# EAGLE design Statemachine_ST7735.R03 (EAGLE 6.5.0)
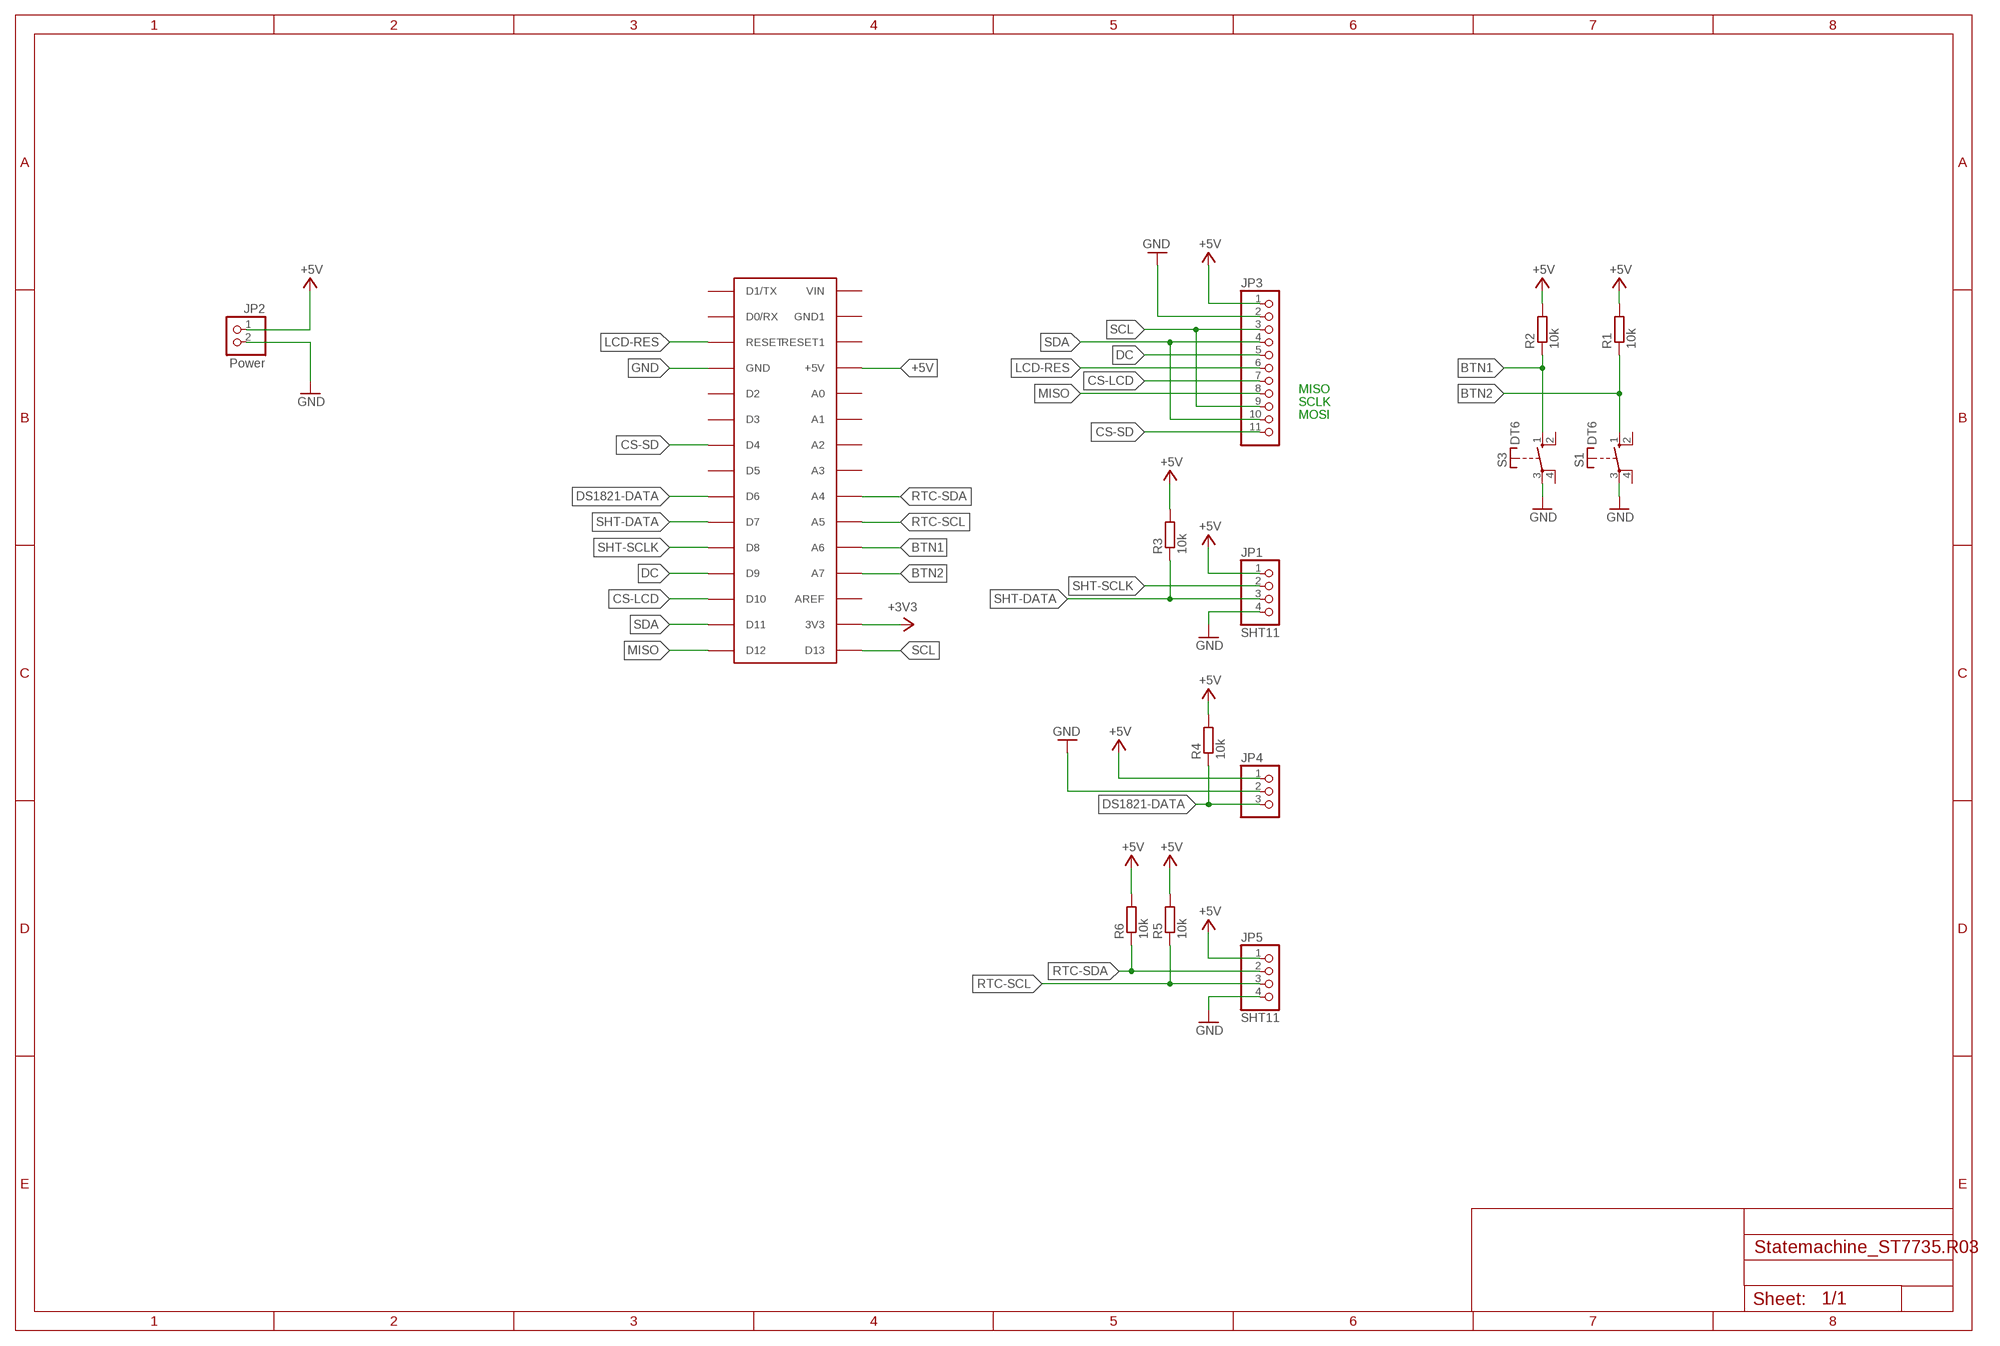
[diagram p0: schematic, sheet 1]

## Parts
JP1  SHT11  PINHD-1X4  [1X04]
JP2  Power  PINHD-1X2  [1X02]
JP3  PINHD-1X11  [1X11]
JP4  PINHD-1X3  [1X03]
JP5  SHT11  PINHD-1X4  [1X04]
NANO  ARDUINONANO  [PDIP-32]
R1  10k  R-EU_0204/7  [0204/7]
R2  10k  R-EU_0204/7  [0204/7]
R3  10k  R-EU_0204/7  [0204/7]
R4  10k  R-EU_0204/7  [0204/7]
R5  10k  R-EU_0204/7  [0204/7]
R6  10k  R-EU_0204/7  [0204/7]
S1  DT6  [DT6]
S3  DT6  [DT6]

## Nets
+3V3: NANO.3V3
+5V: JP1.1 JP2.1 JP3.1 JP4.1 JP5.1 NANO.+5V R1.2 R2.2 R3.2 R4.2 R5.2 R6.2
BTN1: NANO.A6 R2.1 S3.1(S)
BTN2: NANO.A7 R1.1 S1.1(S)
CS-LCD: JP3.7 NANO.D10
CS-SD: JP3.11 NANO.D4
DC: JP3.5 NANO.D9
DS1821-DATA: JP4.3 NANO.D6 R4.1
GND: JP1.4 JP2.2 JP3.2 JP4.2 JP5.4 NANO.GND S1.3(P) S3.3(P)
LCD-RES: JP3.6 NANO.RESET
MISO: JP3.8 NANO.D12
RTC-SCL: JP5.3 NANO.A5 R5.1
RTC-SDA: JP5.2 NANO.A4 R6.1
SCL: JP3.3 JP3.9 NANO.D13
SDA: JP3.4 JP3.10 NANO.D11
SHT-DATA: JP1.3 NANO.D7 R3.1
SHT-SCLK: JP1.2 NANO.D8
Unconnected: NANO.A0 NANO.A1 NANO.A2 NANO.A3 NANO.AREF NANO.D0/RX NANO.D1/TX NANO.D2 NANO.D3 NANO.D5 NANO.GND1 NANO.RESET1 NANO.VIN S1.2(S) S1.4(P) S3.2(S) S3.4(P)

## Notes on the sheet
- MISO
- SCLK
- MOSI

## Library data of the parts
JP1 JP5 = pinhead:PINHD-1X4: PIN HEADER
JP2 = pinhead:PINHD-1X2: PIN HEADER
JP3 = pinhead:PINHD-1X11: PIN HEADER
JP4 = pinhead:PINHD-1X3: PIN HEADER
NANO = arduino:ARDUINONANO
R1-R6 = resistor:R-EU_: RESISTOR, European symbol
S1 S3 = switch-misc:DT: ITT SWITCH

## Board
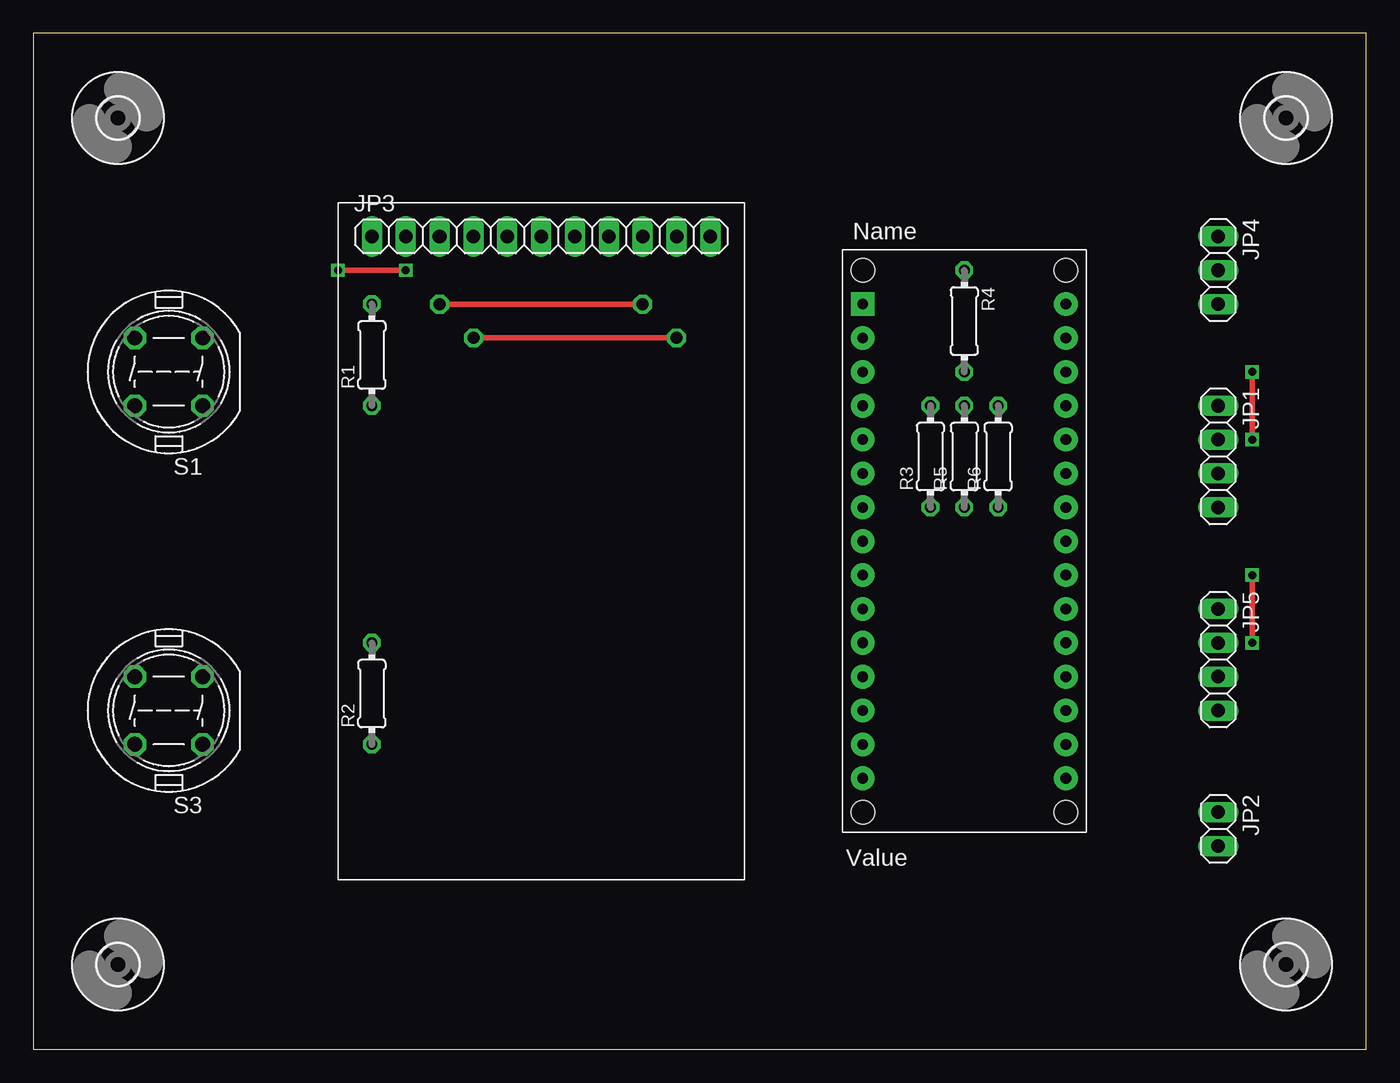
[diagram p1: board, top side]
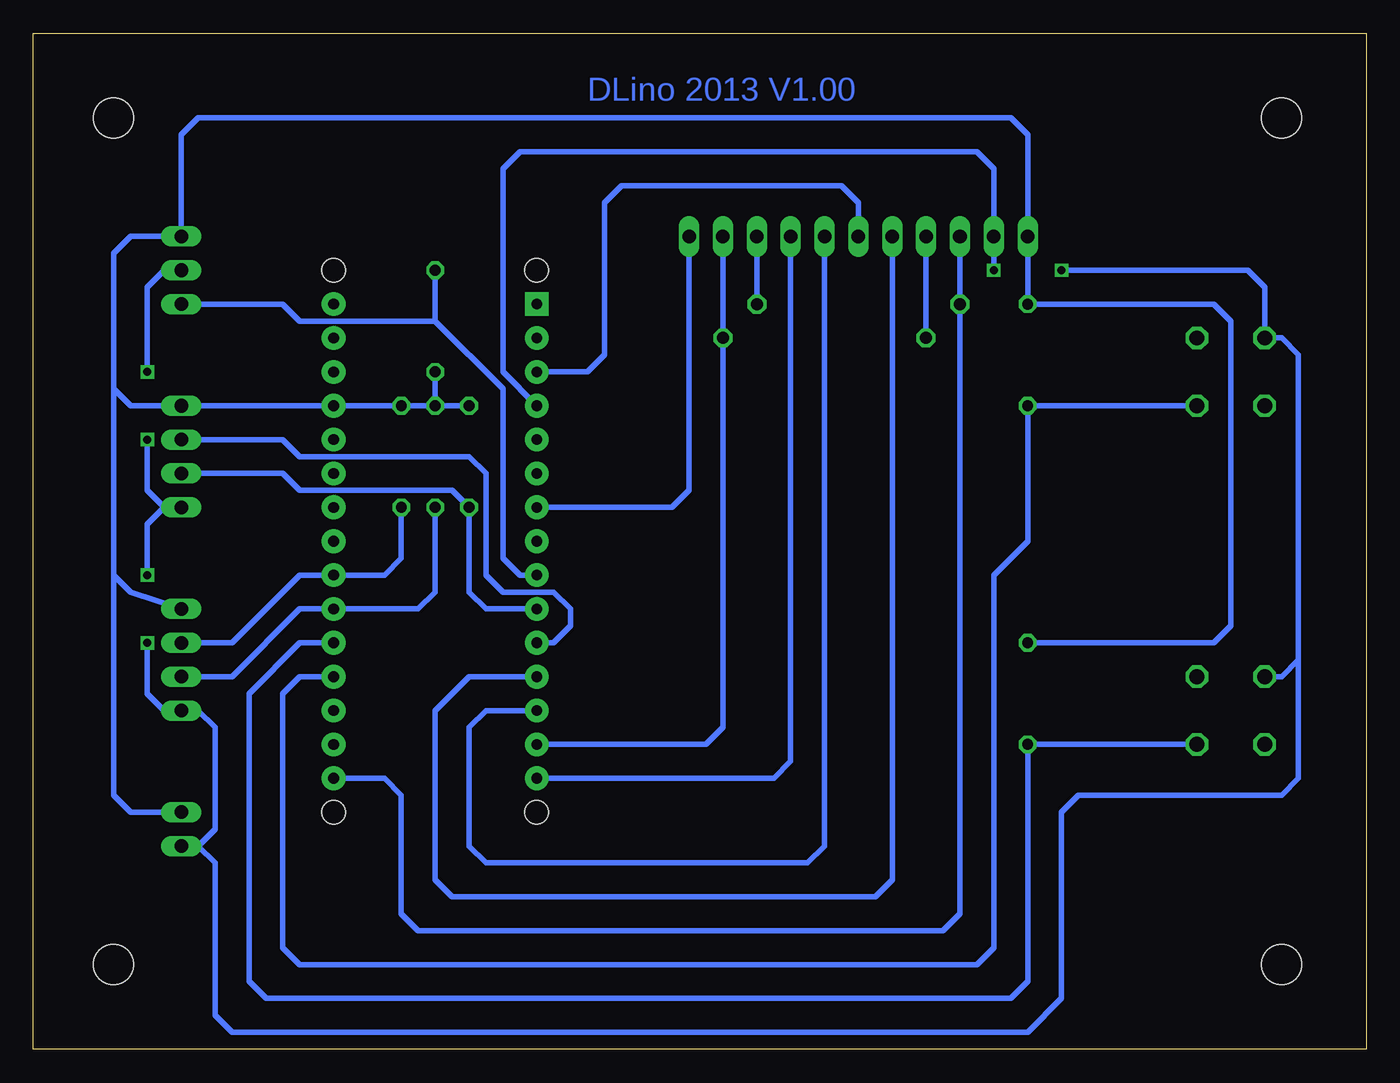
[diagram p2: board, bottom side, seen from below]

Size 100 x 76.19 mm. Coordinates in mm from the lower left corner, seen from the top.
Outline: 0,0 100,0 100,76.19 0,76.19 0,0
Copper layers (1*16): Top 0.035mm / dielectric 1.5mm / Bottom 0.035mm
Design rules "default": minimum track width 10mil, minimum drill 24mil, track to track 8mil, track to pad 8mil, pad to pad 8mil, via to via 8mil, smd to smd 8mil, copper to edge 40mil, drill to drill 8mil, minimum pad ring 10mil, minimum via ring 8mil, stop-mask expansion 4mil, vias tented up to drill 0mil, thermal gap 10mil

### Footprints (pad centres in the part's own frame; a part is rotated, then mirrored left to right if it is on the bottom)
1X04 = drill 1.016 long: 1 -3.81,0; 2 -1.27,0; 3 1.27,0; 4 3.81,0
1X02 = drill 1.016 long: 1 -1.27,0; 2 1.27,0
1X11 = drill 1.016 long: 1 -12.7,0; 2 -10.16,0; 3 -7.62,0; 4 -5.08,0; 5 -2.54,0; 6 0,0; 7 2.54,0; 8 5.08,0; 9 7.62,0; 10 10.16,0; 11 12.7,0
1X03 = drill 1.016 long: 1 -2.54,0; 2 0,0; 3 2.54,0
PDIP-32 = drill 0.8 pad 1.778: 3V3 15.24,-35.56; +5V 15.24,-10.16; A0 15.24,-12.7; A1 15.24,-15.24; A2 15.24,-17.78; A3 15.24,-20.32; A4 15.24,-22.86; A5 15.24,-25.4; A6 15.24,-27.94; A7 15.24,-30.48; AREF 15.24,-33.02; D0/RX 0,-5.08; D2 0,-12.7; D3 0,-15.24; D4 0,-17.78; D5 0,-20.32; D6 0,-22.86; D7 0,-25.4; D8 0,-27.94; D9 0,-30.48; D10 0,-33.02; D11 0,-35.56; D12 0,-38.1; D13 15.24,-38.1; GND 0,-10.16; GND1 15.24,-5.08; RESET 0,-7.62; RESET1 15.24,-7.62; VIN 15.24,-2.54 | drill 0.8 pad 1.778 square: D1/TX 0,-2.54 | hole 1.778: 0,0; 0,-40.64; 15.24,-40.64; 15.24,0
0204/7 = drill 0.813 octagon: 1 -3.81,0; 2 3.81,0
DT6 = drill 1.118 octagon: 1 -2.54,2.54; 2 2.54,2.54; 3 2.54,-2.54; 4 -2.54,-2.54
3,0 = hole 3: 0,0

### Placement (x,y rotation side)
JP1  88.9,44.45 270 top
JP2  88.9,16.51 270 top
JP3  38.1,60.96 0 top
JP4  88.9,58.42 270 top
JP5  88.9,29.21 270 top
NANO  62.23,58.42 0 top
R1  25.4,52.07 90 top
R2  25.4,26.67 90 top
R3  67.31,44.45 90 top
R4  69.85,54.61 270 top
R5  69.85,44.45 90 top
R6  72.39,44.45 90 top
S1  10.16,50.8 180 top
S3  10.16,25.4 180 top
U$2  [3,0]  6.35,69.85 0 top
U$3  [3,0]  93.98,69.85 0 top
U$4  [3,0]  6.35,6.35 0 top
U$5  [3,0]  93.98,6.35 0 top

### Tracks (layer width: path | path; a pad name or v marks a point on that pad's centre or on a via)
+5V
  Bottom 0.406: R2.2 11.43,30.48 10.16,31.75 10.16,54.61 11.43,55.88 R1.2 | R1.2 JP3.1 | R1.2 25.4,68.58 26.67,69.85 87.63,69.85 88.9,68.58 JP4.1 92.71,60.96 93.98,59.69 93.98,49.53 | JP2.1 92.71,17.78 93.98,19.05 93.98,35.56 | 93.98,35.56 93.98,49.53 | 93.98,49.53 92.71,48.26 JP1.1 NANO.+5V R6.2 R5.2 | JP5.1 92.71,34.29 93.98,35.56 | R4.2 R5.2 | R5.2 R3.2
BTN1
  Bottom 0.406: S3.1 R2.1 25.4,5.08 26.67,3.81 82.55,3.81 83.82,5.08 83.82,26.67 80.01,30.48 NANO.A6
BTN2
  Bottom 0.406: S1.1 R1.1 25.4,38.1 27.94,35.56 27.94,7.62 29.21,6.35 80.01,6.35 81.28,7.62 81.28,26.67 80.01,27.94 NANO.A7
CS-LCD
  Bottom 0.406: NANO.D10 66.04,25.4 67.31,24.13 67.31,15.24 66.04,13.97 41.91,13.97 40.64,15.24 JP3.7
CS-SD
  Bottom 0.406: NANO.D4 52.07,40.64 50.8,41.91 JP3.11
DC
  Bottom 0.406: NANO.D9 67.31,27.94 69.85,25.4 69.85,12.7 68.58,11.43 36.83,11.43 35.56,12.7 JP3.5
DS1821-DATA
  Bottom 0.406: 90.17,55.88 JP4.3 81.28,55.88 80.01,54.61 69.85,54.61 | NANO.D6 63.5,35.56 64.77,36.83 64.77,49.53 69.85,54.61 | 69.85,54.61 R4.1
GND  (via drill 0.6)
  Top 0.406: v91.44,50.8 v91.44,45.72 | v91.44,35.56 v91.44,30.48 | v27.94,58.42 v22.86,58.42
  Bottom 0.406: S3.3 6.35,27.94 5.08,29.21 | 5.08,29.21 5.08,52.07 6.35,53.34 S1.3 7.62,57.15 8.89,58.42 v22.86,58.42 | JP4.2 90.17,58.42 91.44,57.15 v91.44,50.8 | v91.44,45.72 91.44,41.91 90.17,40.64 | JP1.4 90.17,40.64 | 90.17,40.64 91.44,39.37 v91.44,35.56 | v91.44,30.48 91.44,26.67 90.17,25.4 JP5.4 87.63,25.4 86.36,24.13 86.36,16.51 87.63,15.24 | JP3.2 v27.94,58.42 27.94,66.04 29.21,67.31 63.5,67.31 64.77,66.04 64.77,50.8 NANO.GND | JP2.2 87.63,15.24 | 87.63,15.24 86.36,13.97 86.36,2.54 85.09,1.27 25.4,1.27 22.86,3.81 22.86,17.78 21.59,19.05 6.35,19.05 5.08,20.32 5.08,29.21
LCD-RES
  Bottom 0.406: NANO.RESET 58.42,50.8 57.15,52.07 57.15,63.5 55.88,64.77 39.37,64.77 38.1,63.5 JP3.6
MISO
  Bottom 0.406: NANO.D12 44.45,20.32 43.18,21.59 JP3.8
RTC-SCL
  Bottom 0.406: R5.1 69.85,34.29 71.12,33.02 NANO.A5 80.01,33.02 85.09,27.94 JP5.3
RTC-SDA
  Bottom 0.406: R6.1 72.39,36.83 73.66,35.56 NANO.A4 80.01,35.56 85.09,30.48 JP5.2
SCL  (via drill 0.9 pad 1.42)
  Top 0.406: v45.72,55.88 v30.48,55.88
  Bottom 0.406: NANO.D13 73.66,20.32 72.39,19.05 72.39,10.16 71.12,8.89 31.75,8.89 30.48,10.16 v30.48,55.88 JP3.3 | JP3.9 v45.72,55.88
SDA  (via drill 0.9 pad 1.42)
  Top 0.406: v33.02,53.34 v48.26,53.34
  Bottom 0.406: NANO.D11 49.53,22.86 48.26,24.13 v48.26,53.34 JP3.10 | JP3.4 v33.02,53.34
SHT-DATA
  Bottom 0.406: NANO.D7 66.04,33.02 67.31,34.29 R3.1 68.58,41.91 80.01,41.91 81.28,43.18 JP1.3
SHT-SCLK
  Bottom 0.406: JP1.2 81.28,45.72 80.01,44.45 67.31,44.45 66.04,43.18 66.04,35.56 64.77,34.29 60.96,34.29 59.69,33.02 59.69,31.75 60.96,30.48 NANO.D8

### Text on the board
Bottom: DLino 2013 V1.00